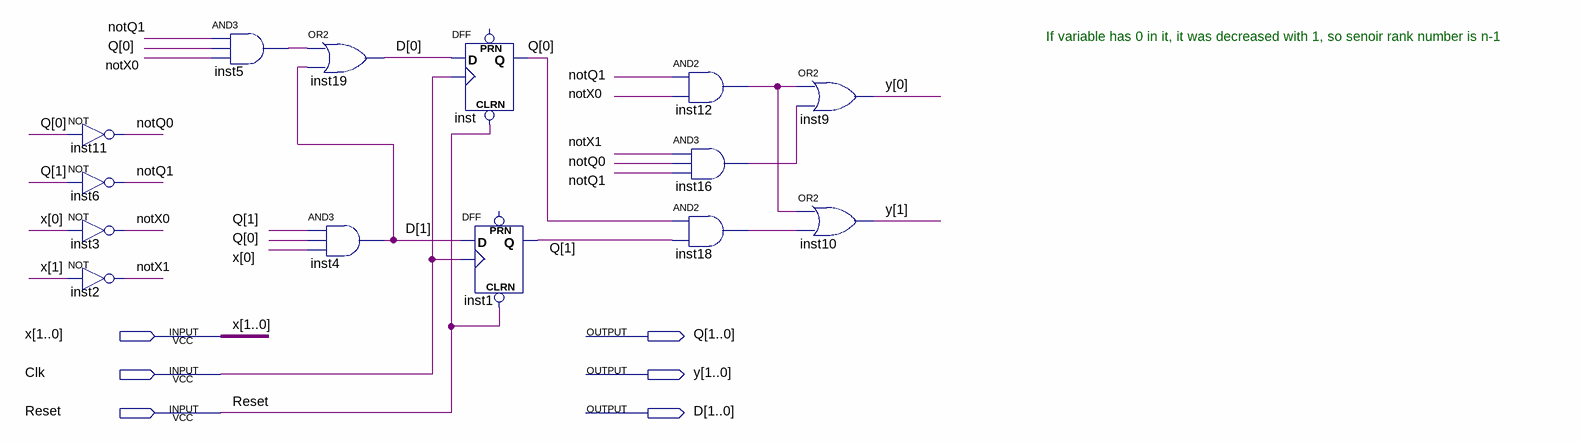
[diagram p0: schematic sheet]
// Quartus schematic Lab8.bdf as structural Verilog: 14 symbols, 6 pins
module Lab8 (
  input  [1:0] x,
  input  Clk,
  input  Reset,
  output [1:0] Q,
  output [1:0] y,
  output [1:0] D
);

  wire inst5_out, inst12_out, inst16_out, inst18_out, notQ0, notQ1, notX0, notX1;

  not inst11 (notQ0, Q[0]);
  not inst6 (notQ1, Q[1]);
  not inst3 (notX0, x[0]);
  not inst2 (notX1, x[1]);
  and inst5 (inst5_out, notQ1, Q[0], notX0);
  or inst19 (D[0], inst5_out, D[1]);
  and inst4 (D[1], Q[1], Q[0], x[0]);
  DFF inst (.CLRN(Reset), .CLK(Clk), .D(D[0]), .Q(Q[0]));  // open: PRN
  DFF inst1 (.CLRN(Reset), .CLK(Clk), .D(D[1]), .Q(Q[1]));  // open: PRN
  and inst12 (inst12_out, notQ1, notX0);
  and inst16 (inst16_out, notX1, notQ0, notQ1);
  and inst18 (inst18_out, Q[0], Q[1]);
  or inst9 (y[0], inst12_out, inst16_out);
  or inst10 (y[1], inst12_out, inst18_out);

  // Notes on the sheet:
  //   If variable has 0 in it, it was decreased with 1, so senoir rank number is n-1
endmodule
